# Altium project TFT_OLED_Board.PrjPCB
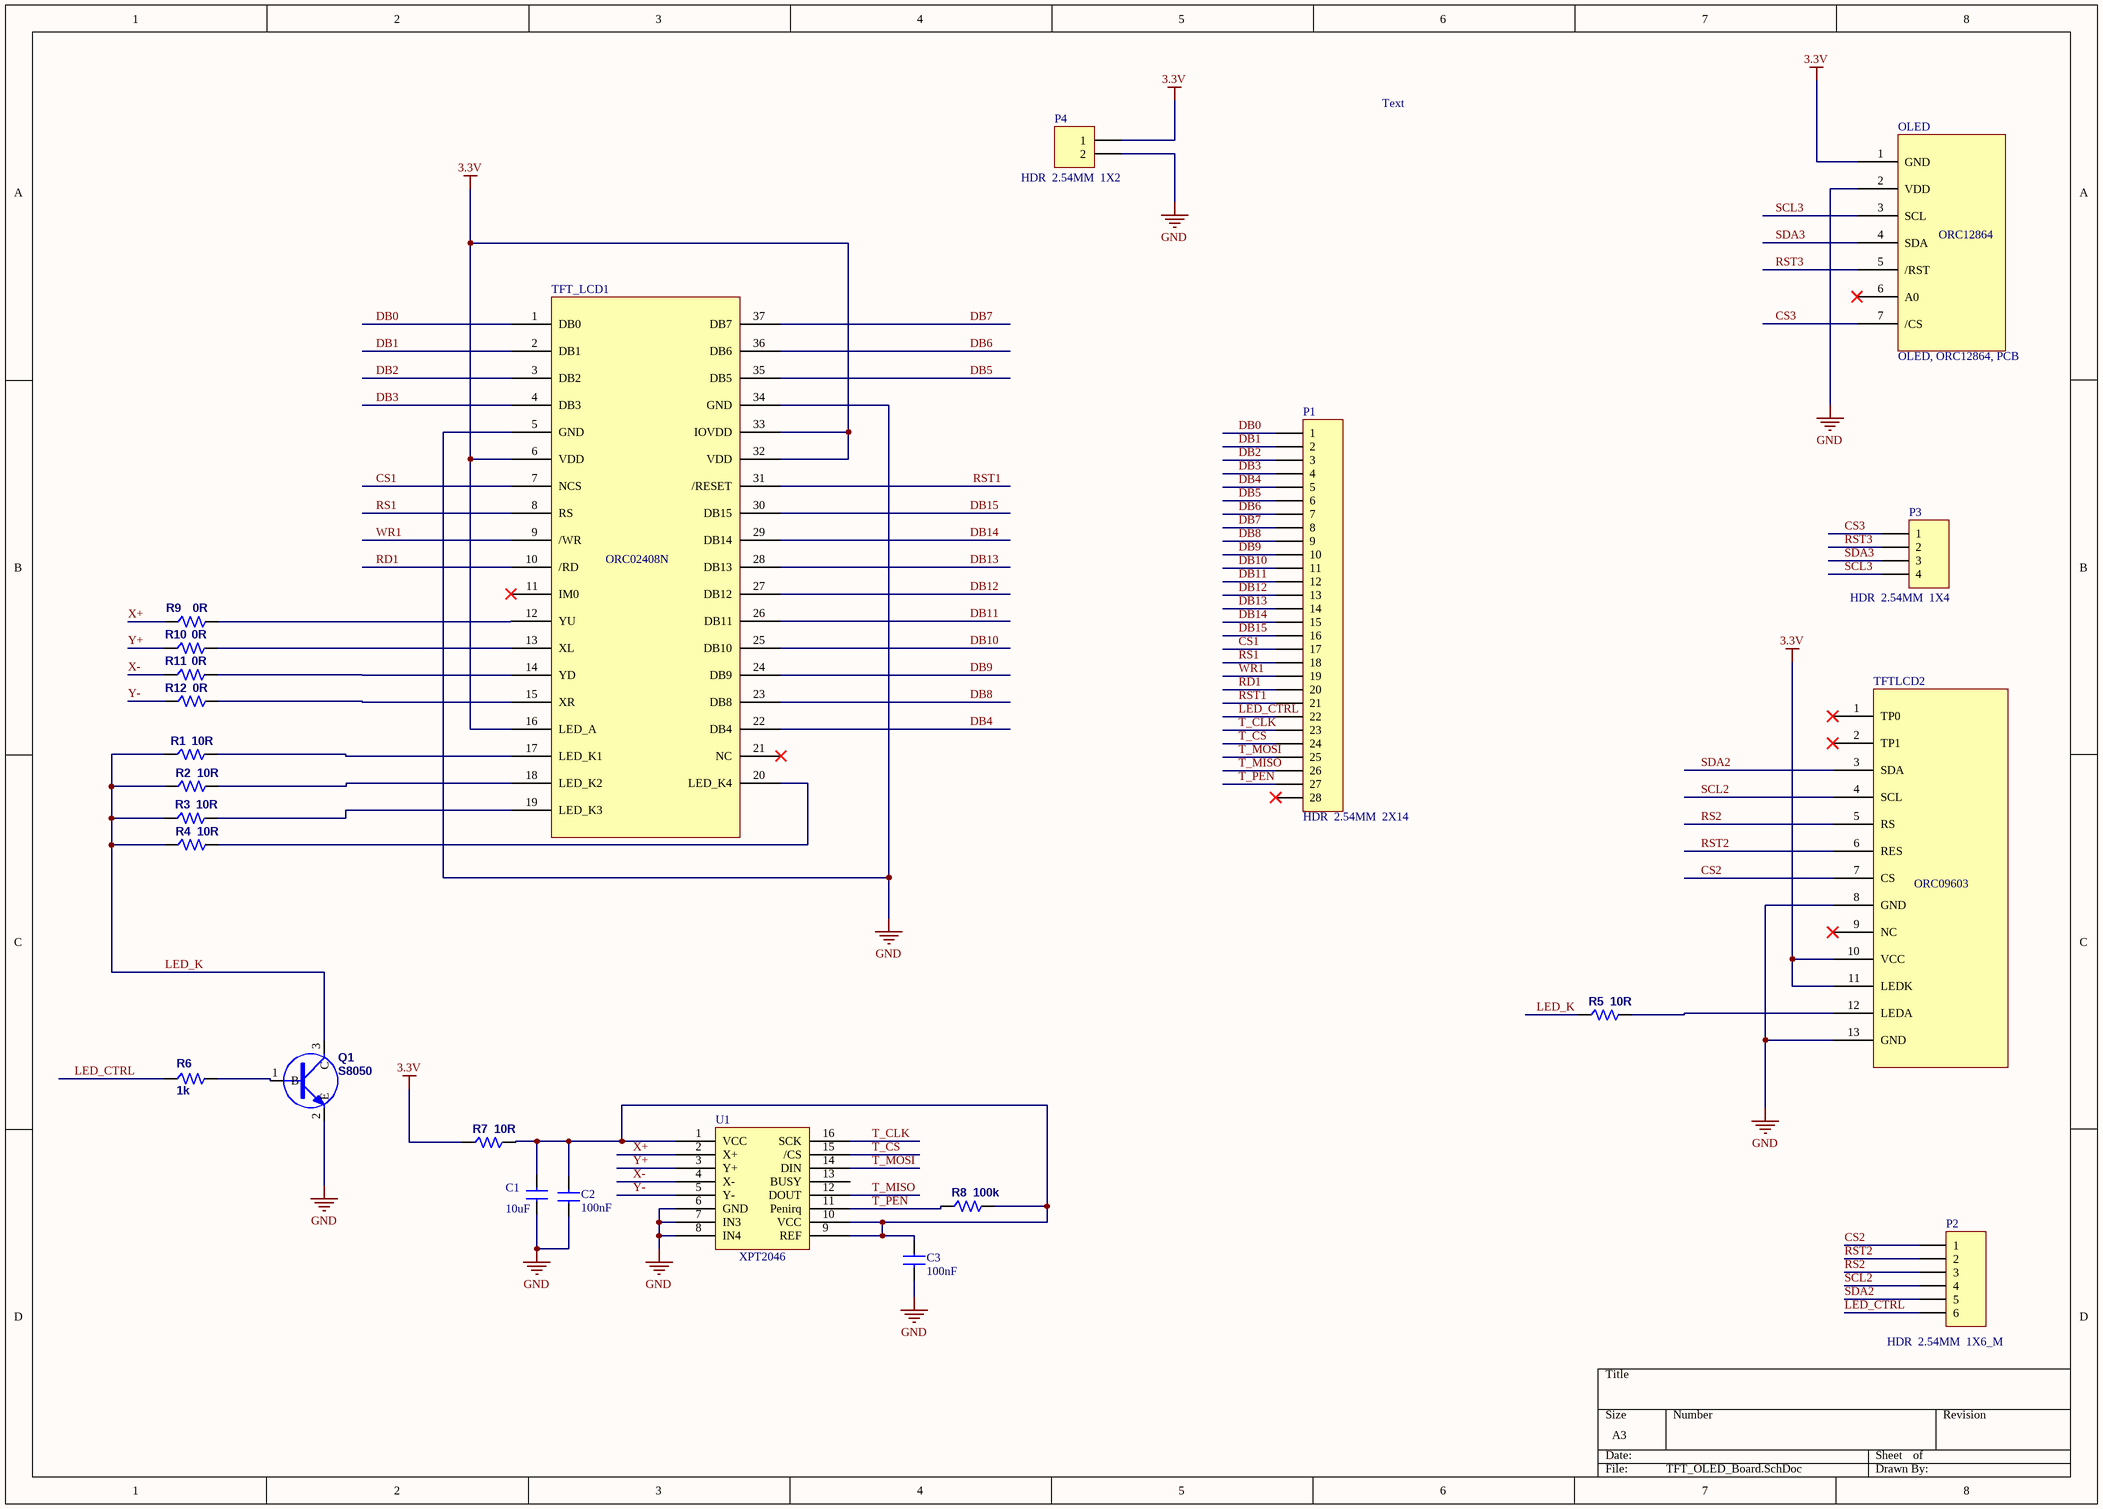
[diagram p0: TFT_OLED_Board.SchDoc]
1 sheet, 24 parts. Net scope: global (net labels, ports and power ports of the same name join across sheets).
Board file: TFT_OLED_Board.PcbDoc

## Sheet TFT_OLED_Board.SchDoc
size A3

### Parts
C1  10uF  [C0603]
C2  100nF  [C0603]
C3  100nF  [C1206]
OLED  OLED, ORC12864, PCB  [PH2.0  7P]
P1  HDR  2.54MM  2X14  [HDR-14X2]
P2  HDR  2.54MM  1X6_M  [HDR-1X6_M]
P3  HDR  2.54MM  1X4  [HDR-1X4]
P4  HDR  2.54MM  1X2  [HDR-1x2]
Q1  S8050  [SOT 23]
R1  10R  [R0603]
R2  10R  [R0603]
R3  10R  [R0603]
R4  10R  [R0603]
R5  10R  [R0603]
R6  1k  [R0603]
R7  10R  [R0603]
R8  100k  [R0603]
R9  0R  [R0603]
R10  0R  [R0603]
R11  0R  [R0603]
R12  0R  [R0603]
TFT_LCD1  TFTLCD, ORC02408N  [FPC  1.0  37P 0.6]  (value not drawn)
TFTLCD2  TFT_LCD, ORC09603  [FPC  0.3  13P]  (value not drawn)
U1  XPT2046  [TSSOP 16]

### Nets
3.3V: OLED.1(GND) P4.1 R7.1 TFT_LCD1.6(VDD) TFT_LCD1.16(LED_A) TFT_LCD1.32(VDD) TFT_LCD1.33(IOVDD) TFTLCD2.10(VCC) TFTLCD2.11(LEDK)
GND: C1.2 C2.2 C3.2 OLED.2(VDD) P4.2 Q1.2(E) TFT_LCD1.5(GND) TFT_LCD1.34(GND) TFTLCD2.8(GND) TFTLCD2.13(GND) U1.6(GND) U1.7(IN3) U1.8(IN4)
CS1: P1.17 TFT_LCD1.7(NCS)
CS2: P2.1 TFTLCD2.7(CS)
CS3: OLED.7(/CS) P3.1
DB0: P1.1 TFT_LCD1.1(DB0)
DB1: P1.2 TFT_LCD1.2(DB1)
DB2: P1.3 TFT_LCD1.3(DB2)
DB3: P1.4 TFT_LCD1.4(DB3)
DB4: P1.5 TFT_LCD1.22(DB4)
DB5: P1.6 TFT_LCD1.35(DB5)
DB6: P1.7 TFT_LCD1.36(DB6)
DB7: P1.8 TFT_LCD1.37(DB7)
DB8: P1.9 TFT_LCD1.23(DB8)
DB9: P1.10 TFT_LCD1.24(DB9)
DB10: P1.11 TFT_LCD1.25(DB10)
DB11: P1.12 TFT_LCD1.26(DB11)
DB12: P1.13 TFT_LCD1.27(DB12)
DB13: P1.14 TFT_LCD1.28(DB13)
DB14: P1.15 TFT_LCD1.29(DB14)
DB15: P1.16 TFT_LCD1.30(DB15)
LED_CTRL: P1.22 P2.6 R6.1
LED_K: Q1.3(C) R1.1 R2.1 R3.1 R4.1 R5.1
RD1: P1.20 TFT_LCD1.10(/RD)
RS1: P1.18 TFT_LCD1.8(RS)
RS2: P2.3 TFTLCD2.5(RS)
RST1: P1.21 TFT_LCD1.31(/RESET)
RST2: P2.2 TFTLCD2.6(RES)
RST3: OLED.5(/RST) P3.2
SCL2: P2.4 TFTLCD2.4(SCL)
SCL3: OLED.3(SCL) P3.4
SDA2: P2.5 TFTLCD2.3(SDA)
SDA3: OLED.4(SDA) P3.3
T_CLK: P1.23 U1.16(SCK)
T_CS: P1.24 U1.15(/CS)
T_MISO: P1.26 U1.12(DOUT)
T_MOSI: P1.25 U1.14(DIN)
T_PEN: P1.27 R8.1 U1.11(Penirq)
WR1: P1.19 TFT_LCD1.9(/WR)
X+: R9.1 U1.2(X+)
X-: R11.1 U1.4(X-)
Y+: R10.1 U1.3(Y+)
Y-: R12.1 U1.5(Y-)
NetC1_1: C1.1 C2.1 C3.1 R7.2 R8.2 U1.1(VCC) U1.9(REF) U1.10(VCC)
NetQ1_1: Q1.1(B) R6.2
NetR1_2: R1.2 TFT_LCD1.17(LED_K1)
NetR2_2: R2.2 TFT_LCD1.18(LED_K2)
NetR3_2: R3.2 TFT_LCD1.19(LED_K3)
NetR4_2: R4.2 TFT_LCD1.20(LED_K4)
NetR5_2: R5.2 TFTLCD2.12(LEDA)
NetR9_2: R9.2 TFT_LCD1.12(YU)
NetR10_2: R10.2 TFT_LCD1.13(XL)
NetR11_2: R11.2 TFT_LCD1.14(YD)
NetR12_2: R12.2 TFT_LCD1.15(XR)

Not connected (* = marked no-connect by the designer): OLED 6(A0)*; P1 28*; TFT_LCD1 11(IM0)* 21(NC)*; TFTLCD2 1(TP0)* 2(TP1)* 9(NC)*; U1 13(BUSY)

### Notes on the sheet
- Text
- (in symbol OLED_ORC12864) ORC12864
- (in symbol TFT_ORC02408N) ORC02408N
- (in symbol TFT_ORC09603) ORC09603

### Library data of the parts
C1 = CAP 1206-10uF/50V: 1206-10UF/50V  106K 贴片层叠电容; 助记码: 1206-10UF/50V  106K TPCDDR; 物料代码: 3.01.02.02.01.02.0029; 仓库名称: 元件仓; 单位: 只; 加工方式: 贴片; 物料名称: 1206-10UF/50V  106K 贴片层叠电容; 规格型号: *
C2 C3 = CAP 1206-100nF/50V: 1206-100nF/50V-J5 104K 贴片层叠电容; 助记码: 1206-100nF/50V  104K; 物料代码: 3.01.02.02.01.02.0001; 仓库名称: 元件仓; 单位: 只; 加工方式: 贴片; 物料名称: 1206-100nF/50V-J5 104K 贴片层叠电容; 规格型号: *
OLED = OLED_ORC12864
P1 = HDR  2.54MM  2X14: 仓库名称: 五金仓; 加工方式: 插件; 助记码: *; 单位: *; 备注: *; 物料代码: *; 物料名称: *; 规格型号: *
P2 = HDR  2.54MM  1X6_M: 仓库名称: 五金仓; 加工方式: 插件; 物料名称: *; 规格型号: *; 助记码: *; 单位: *; 备注: *; 物料代码: *
P3 = HDR  2.54MM  1X4: 仓库名称: 五金仓; 加工方式: 插件; 规格型号: *; 助记码: *; 单位: *; 备注: *; 物料代码: *; 物料名称: *
P4 = HDR  2.54MM  1X2: 仓库名称: 五金仓; 加工方式: 插件; 规格型号: *; 物料名称: *; 助记码: *; 单位: *; 备注: *; 物料代码: *
Q1 = NPN: 物料名称: *; 物料代码: *; 规格型号: *; 助记码: *; 仓库名称: *; 单位: *; 加工方式: *
R1-R12 = RES  0603  0R: 0603  0R  5%  贴片电阻; 物料代码: 3.01.03.01.01.0042; 仓库名称: 元件仓; 助记码: 0603  0R  5%  TPDZ; 单位: 只; 加工方式: 贴片; 物料名称: 0603  0R  5%  贴片电阻; 规格型号: *
TFT_LCD1 = TFT_ORC02408N
TFTLCD2 = TFT_ORC09603
U1 = XPT2046: HR2046贴片IC; 物料代码: 3.01.04.02.0081; 助记码: HR2046TPIC; 仓库名称: 元件仓; 规格型号: TSSOP-16; 单位: 只; 加工方式: 贴片; 物料名称: HR2046贴片IC